# Altium schematic sheet CurrentSource.SchDoc
size A4; SheetNumber: 1; SheetTotal: 1; SPICEModelCacheENTVPGVK: <root> / <DocumentId>ENTVPGVK</DocumentId> / </root>
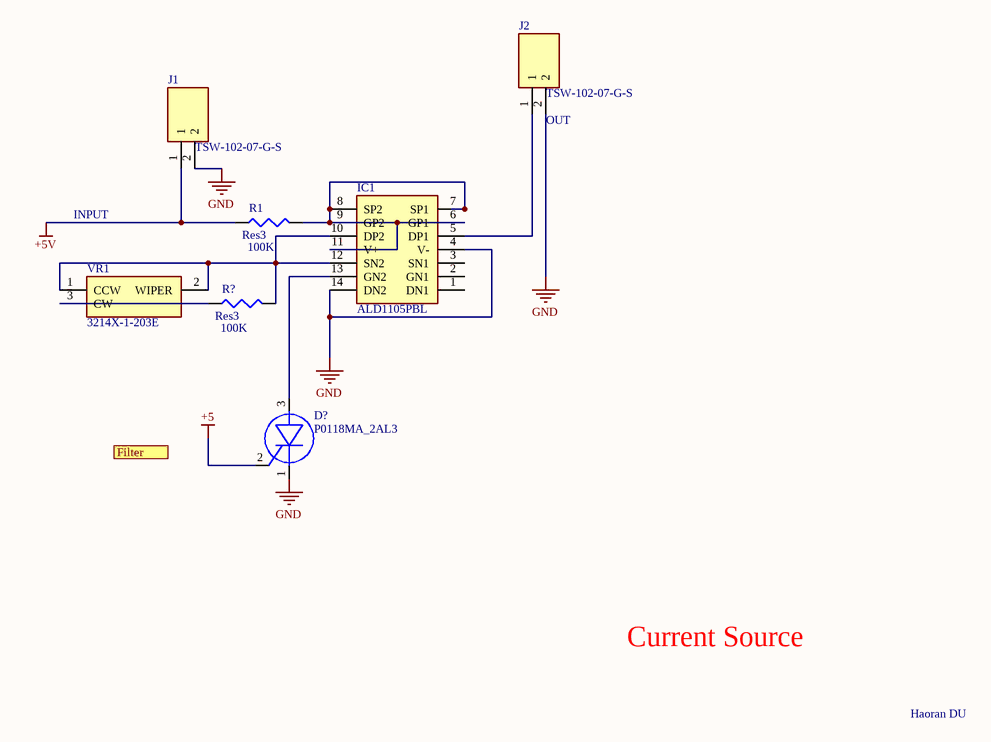
[diagram p0: CurrentSource.SchDoc]

## Parts
D?  P0118MA_2AL3  [TS1107A1AP]
IC1  ALD1105PBL  [DIP762W51P254L1828H508Q14N]
J1  TSW-102-07-G-S  [TSW-102-XX-YY-S]
J2  TSW-102-07-G-S  [TSW-102-XX-YY-S]
R1  Res3  value 100K  [J1-0603]
R?  Res3  value 100K  [J1-0603]
VR1  3214X-1-203E  [3214X1203E]

## Ports
Filter (in)

## Nets
+5: D?.2(G)
+5V: J1.1 R1.1
GND: D?.1(K) IC1.4(V-) IC1.14(DN2) J1.2 J2.2
NetD?_3: D?.3(A) IC1.13(GN2)
NetIC1_5: IC1.5(DP1) J2.1
NetIC1_6: IC1.6(GP1) IC1.7(SP1) IC1.8(SP2) IC1.9(GP2) IC1.11(V+) R1.2
NetIC1_10: IC1.10(DP2) IC1.12(SN2) R?.2 VR1.1(CCW) VR1.2(WIPER)
NetR?_1: R?.1 VR1.3(CW)

Not connected (* = marked no-connect by the designer): IC1 1(DN1) 2(GN1) 3(SN1)

## Notes on the sheet
- (near J2) OUT
- INPUT
- Current Source
- Haoran DU

## Library data of the parts
D? = P0118MA_2AL3: SCR; Manufacturer_Name: STMicroelectronics; Manufacturer_Part_Number: P0118MA 2AL3; Datasheet Link: https://www.st.com/resource/en/datasheet/p0111da.pdf; Height: 4.95mm; Mouser Part Number: 511-P0118MA2AL3; Mouser Price/Stock: https://www.mouser.co.uk/ProductDetail/STMicroelectronics/P0118MA-2AL3?qs=8g15oU%252BBBJ8Tzu5vi19VdQ%3D%3D
IC1 = ALD1105PBL: Integrated Circuit; Manufacturer_Name: Advanced Linear Devices Inc.; Datasheet Link: https://www.mouser.es/datasheet/2/8/ALD1105-963896.pdf; Height: 5.08mm; Manufacturer_Part_Number: ALD1105PBL; Mouser Part Number: 585-ALD1105PBL; Mouser Price/Stock: https://www.mouser.co.uk/ProductDetail/Advanced-Linear-Devices/ALD1105PBL?qs=Du6x3Vjr3lUq%2FSLBVb98Ng%3D%3D
J1 J2 = TSW-102-07-G-S: Connector; Manufacturer_Name: SAMTEC; Datasheet Link: http://suddendocs.samtec.com/prints/tsw-xxx-xx-xxx-x-xx-xxx-mkt.pdf; Manufacturer_Part_Number: TSW-102-07-G-S; Mouser Part Number: 200-TSW10207GS; Mouser Price/Stock: https://www.mouser.co.uk/ProductDetail/Samtec/TSW-102-07-G-S?qs=iT52DjcXudsNPhlNCDp8vw%3D%3D; Arrow Part Number: TSW-102-07-G-S; Arrow Price/Stock: https://www.arrow.com/en/products/tsw-102-07-g-s/samtec?region=europe
R1 R? = Res3: Resistor; Published: 8-Jun-2000; LatestRevisionDate: 29-May-2009; LatestRevisionNote: IPC-7351 Footprint Added.; PackageReference: J1-0603; Publisher: Altium Limited; PackageDescription: Chip Resistor
VR1 = 3214X-1-203E: Variable Resistor; Manufacturer_Name: Bourns; Datasheet Link: https://www.bourns.com/pdfs/3214.pdf; Height: 5.3mm; Manufacturer_Part_Number: 3214X-1-203E; Mouser Part Number: 652-3214X-1-203E; Mouser Price/Stock: https://www.mouser.co.uk/ProductDetail/Bourns/3214X-1-203E?qs=GbiU%252BivmtKCiZgVfjOTq7A%3D%3D; Arrow Part Number: 3214X-1-203E; Arrow Price/Stock: https://www.arrow.com/en/products/3214x-1-203e/bourns?region=nac